# Altium schematic sheet USB-UART PL2303(HX).SchDoc
size A4
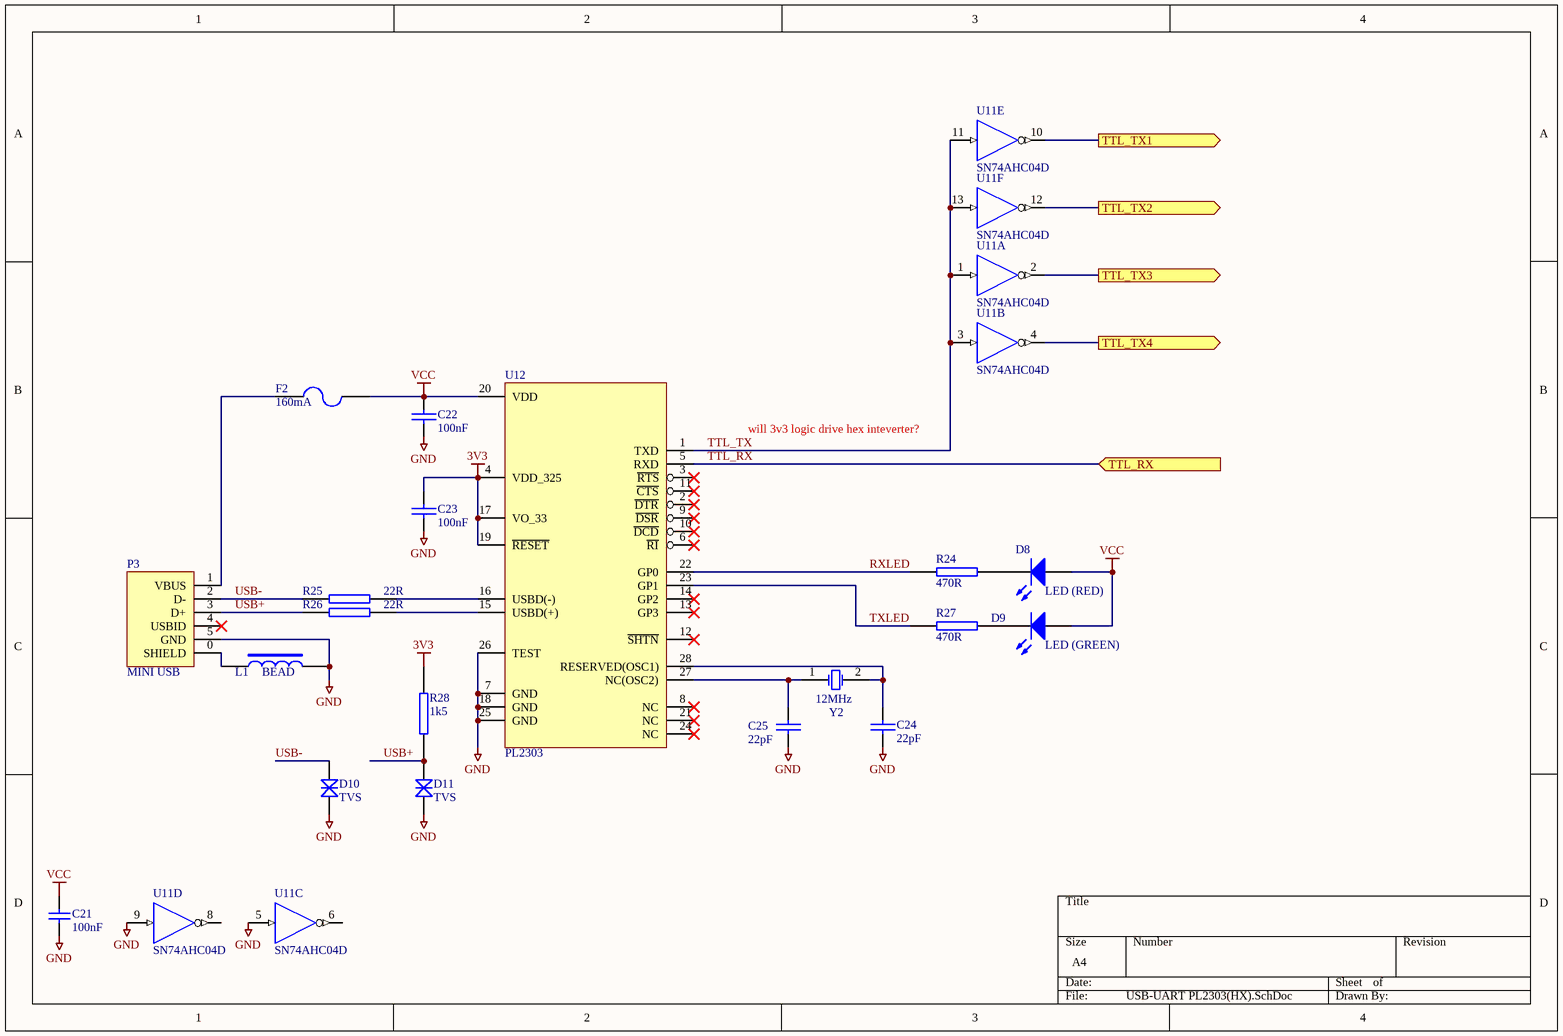
[diagram p0: USB-UART PL2303(HX).SchDoc]

## Parts
C21  100nF  [CAP (3D) - 0603]
C22  100nF  [CAP (3D) - 0603]
C23  100nF  [CAP (3D) - 0603]
C24  22pF  [CAP (3D) - 0603]
C25  22pF  [CAP (3D) - 0603]
D8  LED (RED)  [LED(3D) 3MM VERTICAL (RED)]
D9  LED (GREEN)  [LED(3D) 3MM VERTICAL (GREEN)]
D10  TVS  [TVS (3D) - 0603]
D11  TVS  [TVS (3D) - 0603]
F2  160mA  [1206]
L1  BEAD  [RES (3D) - 1210]
P3  MINI USB  [MINI USB]
R24  470R  [RES (3D) - 0603]
R25  22R  [RES (3D) - 0603]
R26  22R  [RES (3D) - 0603]
R27  470R  [RES (3D) - 0603]
R28  1k5  [RES (3D) - 0603]
U11  SN74AHC04D  [SOIC-14]  (parts A,B,C,D,E,F of 6)
U12  PL2303  [SSOP28]
Y2  value 12MHz  [CRYSTAL 3x8]  (hidden comment: XTAL)

## Ports
TTL_RX, TTL_TX1 (out), TTL_TX2 (out), TTL_TX3 (out), TTL_TX4 (out)

## Nets
3V3: C23.1 R28.1 U12.4(VDD_325) U12.17(VO_33) U12.19(~{RESET})
GND: C21.1 C22.2 C23.2 C24.2 C25.2 D10.1(A) D11.1(A) L1.2 P3.5(GND) U11.5(A) U11.7(GND) U11.9(A) U12.7(GND) U12.18(GND) U12.25(GND) U12.26(TEST)
VCC: C21.2 C22.1 D8.1(A) D9.1(A) F2.2 U11.14(VCC) U12.20(VDD)
RXLED: R24.1 U12.22(GP0)
TTL_RX: U12.5(RXD) ; port TTL_RX
TTL_TX: U11.1(A) U11.3(A) U11.11(A) U11.13(A) U12.1(TXD)
TTL_TX1: U11.10(Y) ; port TTL_TX1
TTL_TX2: U11.12(Y) ; port TTL_TX2
TTL_TX3: U11.2(Y) ; port TTL_TX3
TTL_TX4: U11.4(Y) ; port TTL_TX4
TXLED: R27.1 U12.23(GP1)
USB+: D11.2(K) P3.3(D+) R26.1 R28.2
USB-: D10.2(K) P3.2(D-) R25.1
NetC24_1: C24.1 U12.28(RESERVED(OSC1)) Y2.2(OSC2)
NetC25_1: C25.1 U12.27(NC(OSC2)) Y2.1(OSC1)
NetD8_2: D8.2(K) R24.2
NetD9_2: D9.2(K) R27.2
NetF2_1: F2.1 P3.1(VBUS)
NetL1_1: L1.1 P3.0(SHIELD)
NetR25_2: R25.2 U12.16(USBD(-))
NetR26_2: R26.2 U12.15(USBD(+))

Not connected (* = marked no-connect by the designer): P3 4(USBID)*; U11 6(Y) 8(Y); U12 2(~{DTR})* 3(~{RTS})* 6(~{RI})* 8(NC)* 9(~{DSR})* 10(~{DCD})* 11(~{CTS})* 12(~{SHTN})* 13(GP3)* 14(GP2)* 21(NC)* 24(NC)*

## Notes on the sheet
- will 3v3 logic drive hex inteverter?

## Library data of the parts
C21 = Cap: Capacitor; Value: 100nF; Supplier 1: Mouser; Supplier 2: Digi-Key; Supplier Part Number 1: 603-C0603ZRY5V9BB104; Supplier Part Number 2: 311-1343-2-ND
C22 C23 = CAP SMD 0603 100nF: CAPACITOR SMD 0603; Manufacturer: Murata; Manufacturer Part No.: GCM188R71C104KA37D; Mouser Part no.: 81-GCM188R71C104KA7D; Web link: http://au.mouser.com/ProductDetail/Murata/GCM188R71C104KA37D/?qs=aEuGZpxfbxWKAxwYn%252beTMg%3d%3d; value: 100nF
C24 C25 = CAP SMD 0603 1nF: CAPACITOR SMD 0603; Manufacturer: Vishay; Manufacturer Part No.: VJ0603A220JXACW1BC; value: 22pF; Mouser Part no.: 77-VJ0603A220JXACBC; Web link: http://au.mouser.com/ProductDetail/Vishay-Vitramon/VJ0603A220JXACW1BC/?qs=sGAEpiMZZMv9Q1JI0Mo%2ftTD%2f4380kv7n
D8 = LED 3mm RED: 3mm RED LED; Manufacturer: Lite-On; Manufacturer Part No.: LTL-4261NR; value: RED 3mm; Mouser Part no.: 859-LTL-4261NR; Web link: http://au.mouser.com/ProductDetail/Lite-On/LTL-307E/?qs=sGAEpiMZZMs4quMj8r4lmhnQMFVtnV3yedxNjWAKgTA%3d
D9 = LED 3mm GREEN: 3mm GREEN LED; Manufacturer: Lite-On; Manufacturer Part No.: LTL-1CHG; value: GREEN 3mm; Mouser Part no.: 859-LTL-1CHG; Web link: http://au.mouser.com/ProductDetail/Lite-On/LTL-1CHG/?qs=sGAEpiMZZMs4quMj8r4lmsfF1SjbyuBqGk7sQVhKrYk%3d
D10 D11 = TVS DIODE: Transient Voltage Suppression (TVS) Diode; Manufacturer Part No.: CG0603MLC-05E; Manufacturer: Bourns; Value: TVS; Mouser Part no.: 652-CG0603MLC-05E; Web link: http://au.mouser.com/ProductDetail/Bourns/CG0603MLC-05E/?qs=%2fha2pyFaduj8GWc5RpRwWsoz%252bsBNDfM0b%2fMwO0m8cAS%252b28tb9AwLWQ%3d%3d
F2 = Fuse 2: Fuse; Manufacturer: Littlefuse; Manufacturer Part No.: 1206L016WR; Revision: July-2002: Re-released for DXP Platform.; Mouser Part No.: 576-1206L016WR; Value: 160mA; Web link: http://au.mouser.com/ProductDetail/Littelfuse/1206L016WR/?qs=PWhpLWeW8weybSDHdny44Q%3d%3d
L1 = INDUCTOR SMD 1210 100uH: INDUCTOR SMD 1210; Manufacturer: Fair-Rite; Manufacturer Part No.: 2512063007Y3; Mouser Part no.: 636-2512063007Y3; Web link: http://au.mouser.com/ProductDetail/Fair-Rite/2512063007Y3/?qs=%2fha2pyFadugMqBZ0p6tBCteJ%252bl1Ngi4ZSrBdKx9yVdYrQlmO7YKqKA%3d%3d; Value: BEAD
P3 = MICRO USB: Manufacturer: Keystone Electronics; Manufacturer Part No.: 534-934; value: USB-MICRO; Mouser Part no.: 934; Web link: http://au.mouser.com/ProductDetail/Keystone-Electronics/934/?qs=sGAEpiMZZMulM8LPOQ%252byk%2fSsgKophuqxMvSf7TGGJTc%3d
R24 R27 = RES SMD 0603 590R: RESISTOR SMD 0603 590R; Manufacturer: Vishay; Manufacturer Part No.: CRCW0603470RJNEA; Mouser Part no.: 71-CRCW0603J-470-E3; Web link: http://au.mouser.com/ProductDetail/Vishay-Dale/CRCW0603470RJNEA/?qs=sGAEpiMZZMtlubZbdhIBIDQnfxtYKdcjBa1CNCbPnm4%3d; value: 470R
R25 R26 = RES SMD 0603 0R: RESISTOR SMD 0603 0R; Manufacturer: Xicon; Manufacturer Part No.: 301-22-RC; value: 22R; Mouser Part no.: 301-22-RC; Web link: http://au.mouser.com/ProductDetail/Xicon/301-22-RC/?qs=sGAEpiMZZMu61qfTUdNhG77xSY1jRpIyXwGVN4E99m8%3d
R28 = RES SMD 0603 0R: RESISTOR SMD 0603 0R; value: 1k5
U11 = SN74AHC04D: Hex Inverter; Published: 8-Jun-2000; LatestRevisionDate: 13-Apr-2006; LatestRevisionNote: IPC-7351 Footprint Added.; DatasheetVersion: Jun-1998; PackageVersion: Jan-1998; PackageReference: D014; Publisher: Altium Limited; PackageDescription: 14-Pin Small Outline Integrated Circuit 1.27 mm Pitch; Code_IPC: SOIC127P600-14; ComponentLink1Description: Manufacturer Link; ComponentLink1URL: http://www.ti.com/; ComponentLink2Description: Datasheet; ComponentLink2URL: http://www-s.ti.com/sc/ds/sn74ahc04.pdf; ComponentLink3Description: Packaging Specification; ComponentLink3URL: http://focus.ti.com/lit/ml/mpds177/mpds177.pdf
U12 = PL2303: PL2303 USB to 232 Converter (FT232 Compatible)
Y2 = XTAL: Crystal Oscillator; Web link: http://au.mouser.com/ProductDetail/ECS/ECS-160-20-5PX-TR/?qs=CkbNAJEAr%2fRSmE52Hssuc4XnCMYWVt7B